# Altium schematic sheet Boost 12V.SchDoc
size A4; SheetNumber: 3; SheetTotal: 12
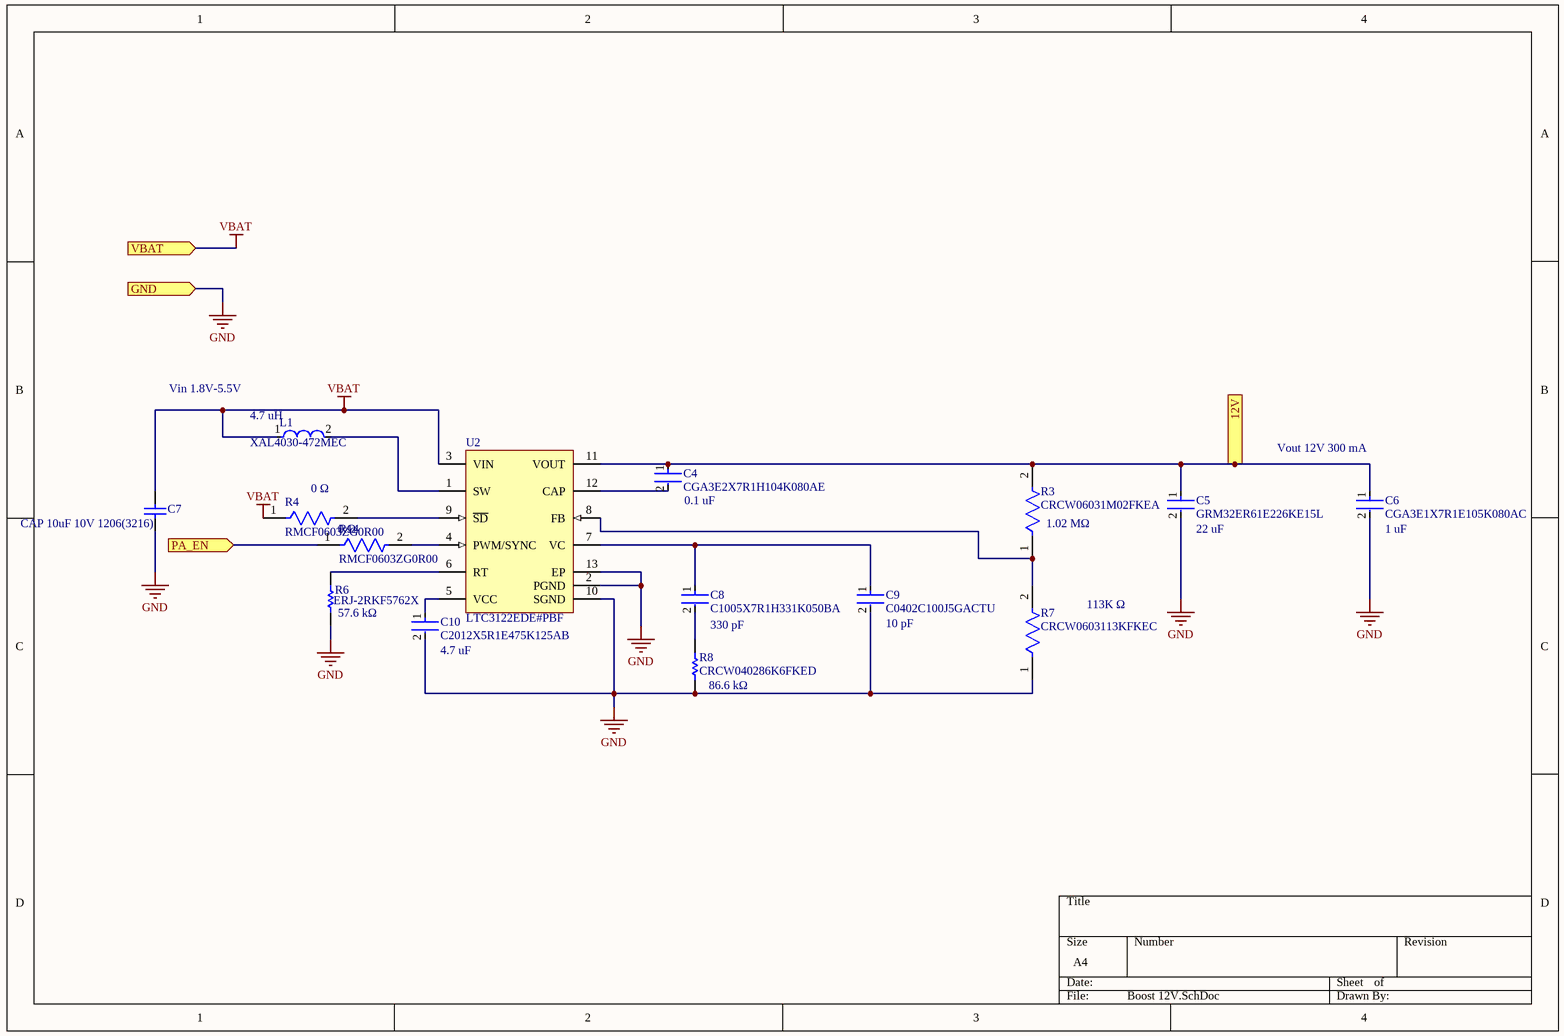
[diagram p0: Boost 12V.SchDoc]

## Parts
C4  CGA3E2X7R1H104K080AE  [FP-CGA3E-0_3-0_1-IPC_A]
C5  GRM32ER61E226KE15L  [FP-GRM32-MFG]
C6  CGA3E1X7R1E105K080AC  [FP-CGA3E-0_3-0_1-IPC_A]
C7  CAP 10uF 10V 1206(3216)  [CAPC1206(3216)190_L]
C8  C1005X7R1H331K050BA  [FP-C1005-050-0_05-IPC_B]
C9  C0402C100J5GACTU  [FP-C0402-BB-MFG]
C10  C2012X5R1E475K125AB  [FP-C2012-125-0_2-MFG]
L1  XAL4030-472MEC  [FP-XAL4030-472MEC-MFG]
R3  CRCW06031M02FKEA  [FP-CRCW0603-e3-IPC_A]
R4  RMCF0603ZG0R00  [FP-RMCF0603-IPC_B]
R6  ERJ-2RKF5762X  [RESC1005X40X25NL05T05]
R7  CRCW0603113KFKEC  [FP-CRCW0603-e3-MFG]
R8  CRCW040286K6FKED  [RESC1005X40X25NL05T05]
R14  RMCF0603ZG0R00  [FP-RMCF0603-IPC_B]
U2  LTC3122EDE#PBF  [LT-DE-UE-12_V]

## Ports
12V (out), GND (in), PA_EN (in), VBAT (in)

## Nets
GND: C5.2 C6.2 C7.1 C9.2 C10.2 R6.1 R7.1 R8.1 U2.2(PGND) U2.10(SGND) U2.13(EP) ; port GND
VBAT: C7.2 L1.1 R4.1 U2.3(VIN) ; port VBAT
12V: C4.1 C5.1 C6.1 R3.2 U2.11(VOUT) ; port 12V
PA_EN: R14.1 ; port PA_EN
NetC4_2: C4.2 U2.12(CAP)
NetC8_1: C8.1 C9.1 U2.7(VC)
NetC8_2: C8.2 R8.2
NetC10_1: C10.1 U2.5(VCC)
NetL1_2: L1.2 U2.1(SW)
NetR3_1: R3.1 R7.2 U2.8(FB)
NetR4_2: R4.2 U2.9(~{SD})
NetR6_2: R6.2 U2.6(RT)
NetR14_2: R14.2 U2.4(PWM/SYNC)

## Notes on the sheet
- Vin 1.8V-5.5V
- (near L1) 4.7 uH
- (near C6) Vout 12V 300 mA
- (near R4) 0 Ω
- (near C4) 0.1 uF
- 0 Ω
- (near R3) 1.02 MΩ
- (near C5) 22 uF
- (near C6) 1 uF
- (near R6) 57.6 kΩ
- (near C10) 4.7 uF
- 330 pF
- (near C9) 10 pF
- 113K Ω
- (near R8) 86.6 kΩ

## Library data of the parts
C4 = CMP-08246-002410-1: Cap Ceramic 100nF 50V X7R 10% Pad SMD 0603 +125°C Automotive T/R; Thickness: 0.035inch; Dielectric: X7R; Height: 0.8mm; Min Operating Temperature: -55°C; Package Quantity: 4000; Voltage Rating: 50V; Voltage Rating (DC): 50V; Lead Free: Lead Free; Case Code (Metric): 1608; Ratings: AEC-Q200; Capacitance: 100nF; Length: 0.063inch; Width: 0.8mm; Weight: 7.1E-05oz; Case/Package: 0603; Case Code (Imperial): 0603; Termination: SMD/SMT; Mount: Surface Mount; Packaging: Tape and Reel; Max Operating Temperature: 125°C; Tolerance: 10%; Features: Soft Termination
C5 = CMP-2000-05458-2: CAP CER 22UF 25V X5R 1210; Manufacturer: Murata Electronics North America; Possible Substitute: GRM32ER61E226KE15K; Other Names: 490-3889-2; Material: Ceramic; Tolerance: 10%; Digikey Description: CAP CER 22UF 25V X5R 1210; Mouser Description: Multilayer Ceramic Capacitors MLCC - SMD/SMT 1210 22uF 25volts X5R 10%; Device Class L2: Capacitors; Height: 2.7mm; Temperature Characteristic: X5R; Category: Cap; RoHS: TRUE; Operating Temperature: -55°C ~ 85°C; Temperature: -55°C to +85°C; Lead Free: Yes; Package: GRM32; Temperature Range High: +85°C; Package / Case: 1210 (3225 Metric); Standard Package: 1,000; Packaging: Cut Tape (CT); Capacitance: 22uF; Thickness (Max): 0.106" (2.70mm); Value: 22uF; Automotive: No; Device Class L1: Passive Components; Voltage - Rated: 25V; Temperature Range Low: -55°C; Size / Dimension: 0.126" L x 0.098" W (3.20mm x 2.50mm); ComponentLink2Description: Datasheet; Device Class L3: Ceramic Capacitors; Temperature Coefficient: X5R; ComponentLink2URL: https://search.murata.co.jp/Ceramy/image/img/A01X/G101/ENG/GRM32ER61E226KE15-01A.pdf; Voltage Rating: 25V; Manufacturer Part Number: GRM32ER61E226KE15L; Octopart: https://octopart.com/grm32er61e226ke15l-murata-197441; Applications: General Purpose; Mounting Type: Surface Mount, MLCC
C6 = CMP-08246-001507-1: Cap Ceramic 1uF 25V X7R 10% Pad SMD 0603 +125°C Automotive T/R; Dielectric: X7R; Capacitance: 1uF; Voltage Rating: 25V; Thickness: 0.035inch; Width: 0.031inch; Ratings: AEC-Q200; Case Code (Metric): 1608; REACH SVHC: No SVHC; Voltage: 25V; Composition: Ceramic; Min Operating Temperature: -55°C; Termination: SMD/SMT; Depth: 0.8mm; Max Operating Temperature: 125°C; Mount: Surface Mount; Weight: 7.1E-05oz; Package Quantity: 4000; Tolerance: 10%; Packaging: Tape and Reel; Lead Free: Lead Free; Case/Package: 0603; Length: 1.6mm; Height: 0.8mm; Case Code (Imperial): 0603; Voltage Rating (DC): 25V
C7 = CMP-1037-04967-1: CAP 10uF 10V ±10% 1206 (3216 Metric) Thickness 1.9mm SMD; Tolerance: Â±10%; Case-Metric: 3216; Case-EIA: 1206; Rated Voltage: 10 V; Max Thickness: 1.9 mm; Technology: SMT; Value: 10uF
C8 = CMP-08246-002681-1: Multilayer Ceramic Capacitors 330pF ±10% 50V X7R SMD 0402; Height: 0.5mm; Min Operating Temperature: -55°C; Construction: Flat; Voltage Rating (DC): 50V; Depth: 0.5mm; Number of Pins: 2; Capacitance: 330pF; Case/Package: 0402; REACH SVHC: No SVHC; Lead Free: Lead Free; Thickness: 0.022inch; Package Quantity: 1; Case Code (Imperial): 0402; Max Operating Temperature: 125°C; RoHS Compliant: Yes; Voltage Rating: 50V; Length: 1mm; Weight: 2.3E-05oz; Width: 0.02inch; Case Code (Metric): 1005; Dielectric Material: Ceramic; Tolerance: 10%; Mount: Surface Mount; Dielectric: X7R; Series: C; Resistor Type: Ceramic; Termination: SMD/SMT; Packaging: Tape and Reel
C9 = CMP-2008-03404-2: Multilayer Ceramic Capacitor, C Series, 10 Pf, - 5%, C0G / Np0, 50 V, 0402 [1005 Metric] Rohs Compliant: Yes; Manufacturer: Kemet; Temperature Coefficient: 15%; Voltage Rating: 50 V; Capacitance: 10 pF; Value: 10 pF; Tolerance: 0.05; Automotive: No; Temperature Range High: +125°C; ComponentLink2Description: Datasheet; Manufacturer Part Number: C0402C100J5GACTU; Material: Ceramic; Lead Free: Yes; ComponentLink2URL: https://content.kemet.com/datasheets/KEM_C1002_X7R_SMD.pdf; Device Class L3: Ceramic Capacitors; RoHS: TRUE; Package: C0402-BB; Temperature: -55°C to +125°C; Temperature Range Low: -55°C; Height: 0.55mm; Mouser Description: Multilayer Ceramic Capacitor, C Series, 10 Pf, - 5%, C0G / Np0, 50 V, 0402 [1005 Metric] Rohs Compliant: Yes; Octopart: https://octopart.com/c0402c100j5gactu-kemet-108448; Digikey Description: Multilayer Ceramic Capacitor, C Series, 10 Pf, - 5%, C0G / Np0, 50 V, 0402 [1005 Metric] Rohs Compliant: Yes; Temperature Characteristic: C0G; Category: Cap; Ipc Land Pattern Name: CAPC10050X50; Device Class L1: Passive Components; Device Class L2: Capacitors
C10 = CMP-08246-004908-1: Multilayer Ceramic Capacitors 4.7μF ±10% 25V X5R SMD 0805; Capacitance: 4.7uF; Lead Free: Lead Free; Thickness: 0.057inch; Packaging: Tape and Reel; Min Operating Temperature: -55°C; RoHS Compliant: Yes; Dielectric: X5R; Weight: 0.000194oz; REACH SVHC: No SVHC; Voltage Rating (DC): 25V; Mount: Surface Mount; Resistor Type: Ceramic; Termination: SMD/SMT; Number of Pins: 2; Case Code (Imperial): 0805; Dielectric Material: Ceramic; Voltage: 25V; Voltage Rating: 25V; Case Code (Metric): 2012; Case/Package: 0805; Max Operating Temperature: 85°C; Height: 1.25mm; Tolerance: 10%; Depth: 1.25mm; Package Quantity: 1; Length: 2mm; Radiation Hardening: No; Width: 1.25mm
L1 = CMP-11268-000082-1: Power Inductor (SMD), 4.7 µH, 5.1 A, Shielded, 4.5 A, XAL40xx Series, 4mm x 4mm x 3.1mm; Tolerance: 20%; DC Resistance (DCR): 44.1mR; Inductance: 4.7uH; Saturation Current: 4.5A; Max DC Current: 5.1A; Self Resonant Frequency: 36MHz; Test Frequency: 100kHz; Core Material: Composite; REACH SVHC: No SVHC; Height: 3.1mm; Package Quantity: 500; Width: 4.3mm; Mount: Surface Mount; RoHS Compliant: Yes; Case/Package: SMD/SMT; Length: 4.3mm; Packaging: Tape and Reel; Max Operating Temperature: 125°C; Min Operating Temperature: -40°C; Series: XAL4030; Termination: SMD/SMT; Inductance Tolerance: 20%; Shielding: Shielded; RMS Current (Irms): 5.1A; Lead Free: Contains Lead
R3 = CMP-2000-03018-2: RES Thick Film, 1.02MΩ, 1%, 0.1W, 100ppm/°C, 0603; Voltage Rating (DC): 75V; Power Rating: 100mW; Resistance: 1.02MR; Features: Automotive AEC-Q200; Depth: 0.85mm; Max Operating Temperature: 155°C; Tolerance: 1%; Package Quantity: 10; Length: 1.55mm; Mount: Surface Mount; Termination: SMD/SMT; Width: 0.033inch; Temperature Coefficient: 100ppm/°C; Min Operating Temperature: -55°C; Composition: Thick Film; Max Power Dissipation: 100mW; Case Code (Imperial): 0603; Case/Package: 0603; Voltage Rating: 75V; Contact Plating: Tin; Case Code (Metric): 1608; Weight: 7.1E-05oz; Lead Free: Lead Free; Height: 0.02inch; Military Standard: Not; Number of Terminations: 2; Radiation Hardening: No; Packaging: Tape and Reel
R4 R14 = CMP-26527-006412-1: 0Ω ±0 0.1W 0603 Thick Film Chip Resistor AEC-Q200 compliant; Max Power Dissipation: 100mW; Resistance: 0R; Width: 0.031inch; RoHS Compliant: Yes; Number of Terminations: 2; Case/Package: 0603; Contact Plating: Tin; Height: 0.022inch; Resistor Type: Thick Film; Mount: Surface Mount; Length: 0.061inch; Features: Automotive AEC-Q200; Series: RMCF; Max Operating Temperature: 155°C; Radiation Hardening: No; Min Operating Temperature: -55°C; Packaging: Tape and Reel
R6 = CMP-2002-01001-1: Manufacturer: Panasonic; Part Number: ERJ-2RKF5762X
R7 = CMP-02407-003381-1: RES Thick Film, 113kΩ, 1%, 0.1W, 100ppm/°C, 0603; Power Rating: 100mW; Resistance: 113kR; Packaging: Tape and Reel; Width: 0.033inch; Lead Free: Lead Free; Case/Package: 0603; Height: 0.02inch; Length: 0.061inch; Max Power Dissipation: 100mW; Composition: Thick Film; Tolerance: 1%; Number of Terminations: 2; Max Operating Temperature: 155°C; Min Operating Temperature: -55°C; Temperature Coefficient: 100ppm/°C; Features: Automotive AEC-Q200; Package Quantity: 20000
R8 = CMP-2002-00247-1: Manufacturer: Vishay Dale; Part Number: CRCW040286K6FKED
U2 = CMP-0492-00369-1: 2.5 A Synchronous Step-Up DC/DC Converter with Output Disconnect, 12-pin SON (DE-UE-12), -40 to 125 degC, Pb-Free; Manufacturer: Linear Technology; Number of Outputs: 1; ComponentLink2URL: http://cds.linear.com/docs/en/datasheet/3122fa.pdf; ComponentLink1URL: http://www.linear.com/; Code_JEDEC: MO-229; ComponentLink2Description: Datasheet; ComponentLink1Description: Manufacturer URL; PackageReference: DE-UE-12; PackageVersion: Rev. D, 06/2010; ComponentLink3Description: Package Specification; PackageDescription: 12-Pin Plastic DFN, Body 4 x 3 mm, Pitch 0.5 mm; PartNumber: LTC3122EDE#PBF; ComponentLink3URL: http://cds.linear.com/docs/en/packaging/DFN_12_05-08-1695.pdf; Mounting Technology: Surface Mount; RoHS: TRUE; DatasheetVersion: Rev. A